# Altium schematic sheet Cyusb3314_Indicator.SchDoc
size 391 x 287 mm
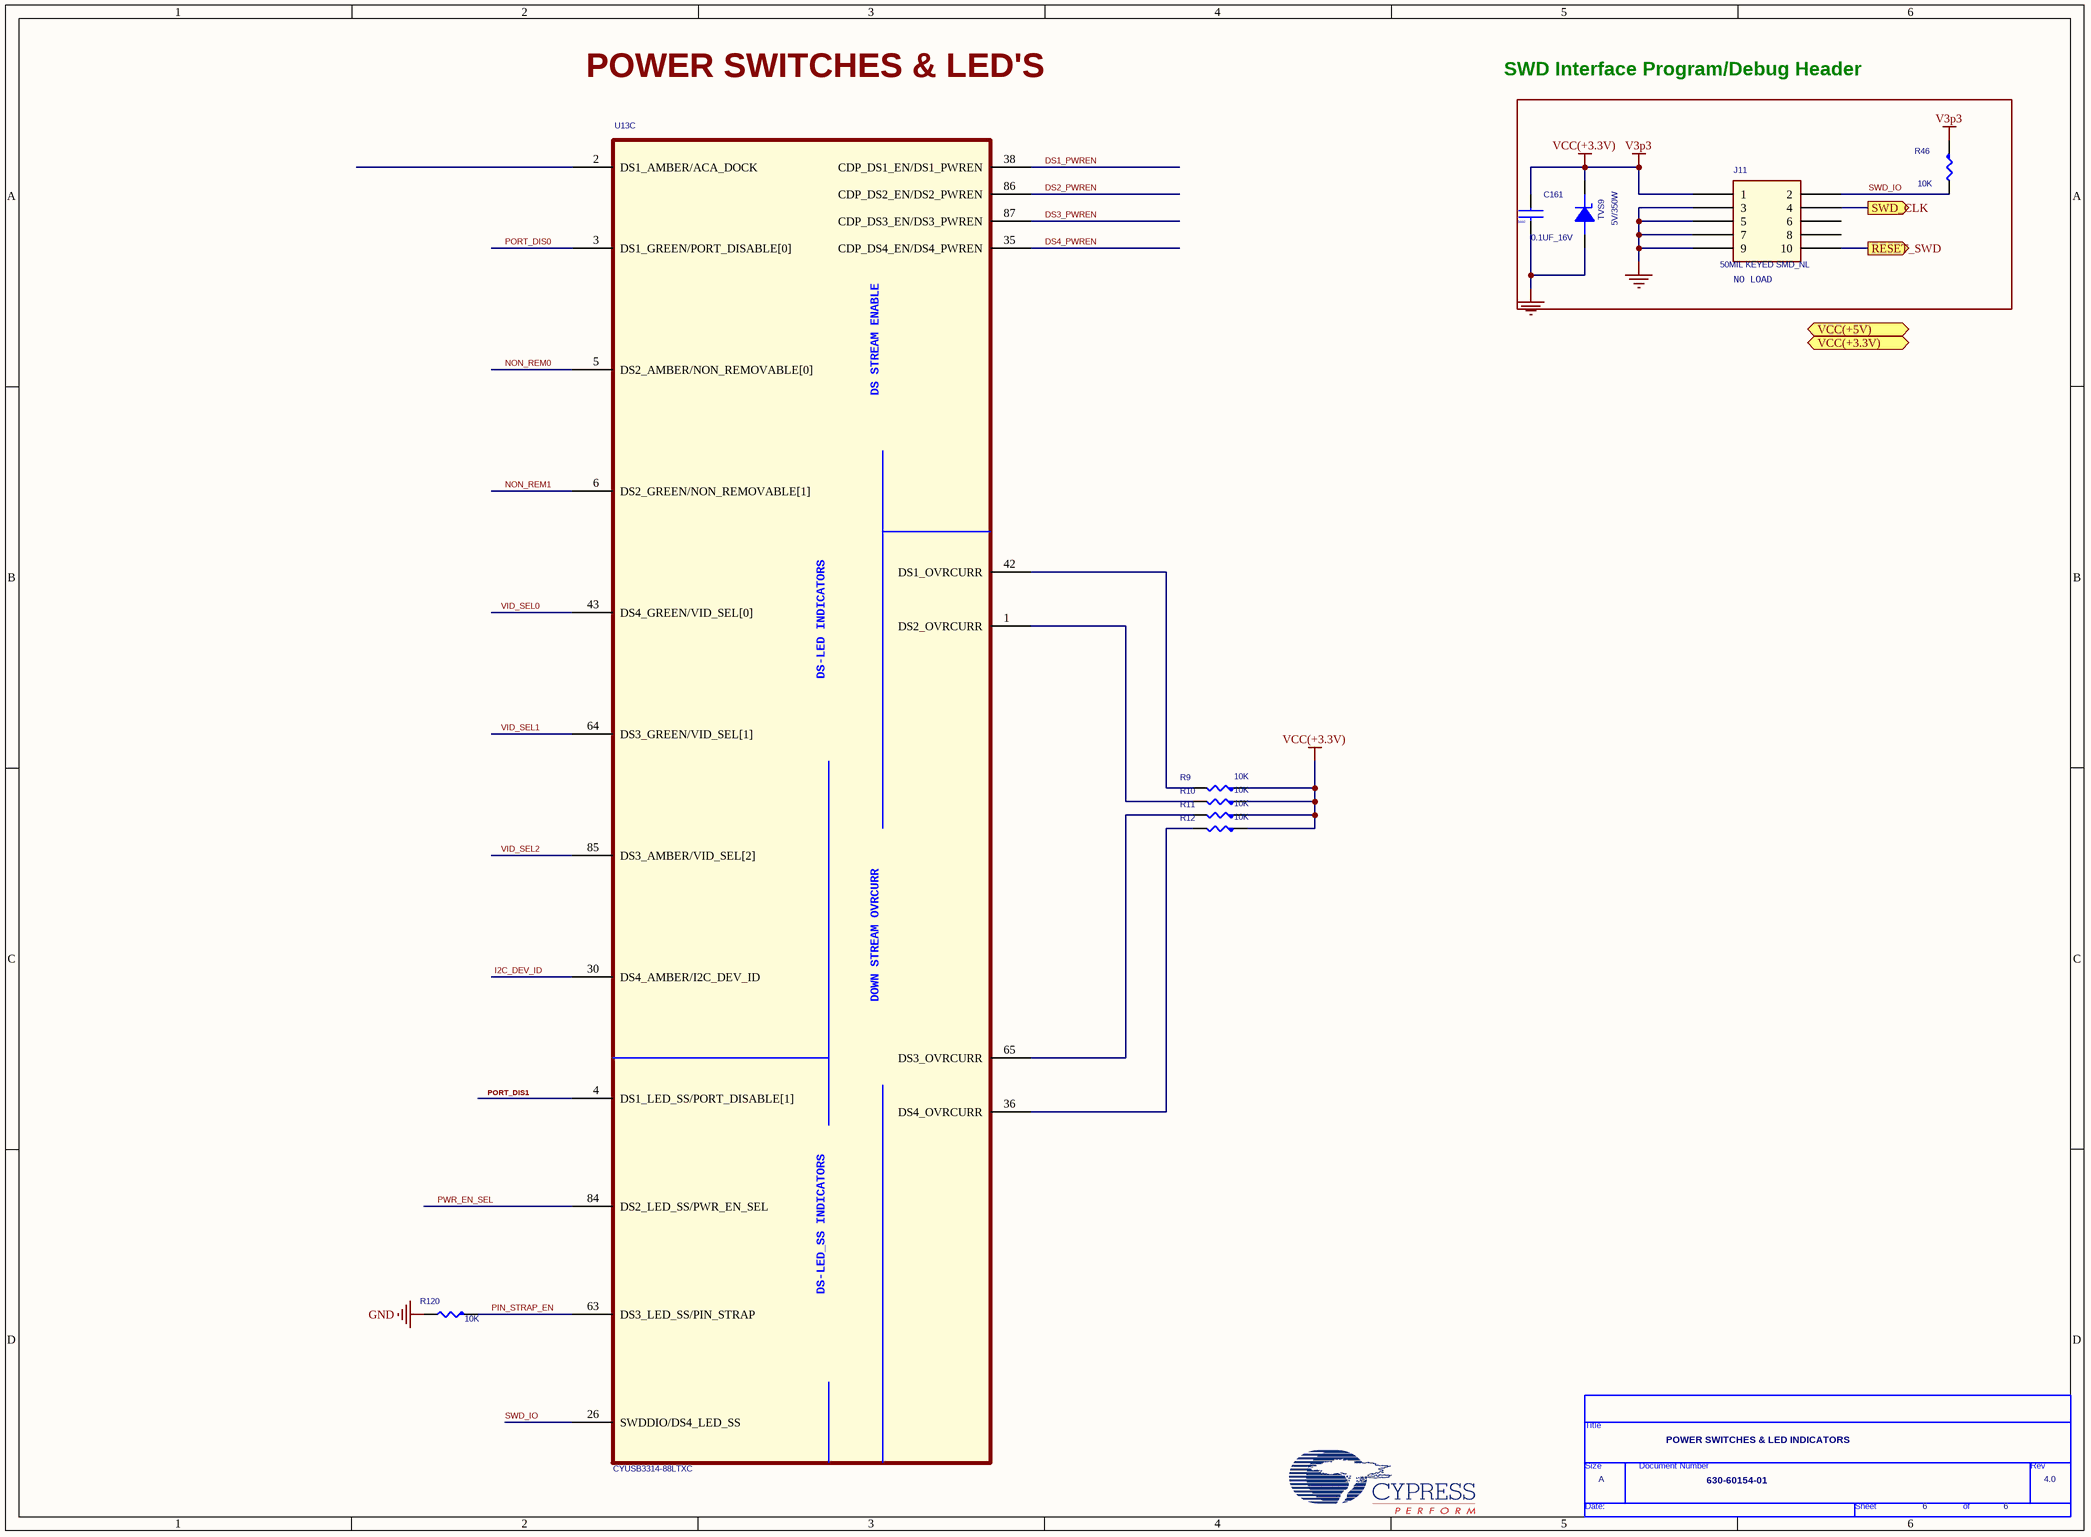
[diagram p0: Cyusb3314_Indicator.SchDoc]

## Parts
*  Page Count: 6  Page Size: A  Title: POWER SWITCHES & LED INDICATORS  RevCode: 4.0  Doc: 630-60154-01  (hidden comment: TitleBlock0)  (graphical)
C161  0.1UF_16V  [C0402]
J11  50MIL KEYED SMD_NL  [SAMTEC_FTSH-105-01-L-DV-K]
R9  10K  [0603S-RES]
R10  10K  [0603S-RES]
R11  10K  [0603S-RES]
R12  10K  [0603S-RES]
R46  10K  [0603S-RES]
R120  10K  [0603S-RES]
TVS9  5V/350W  [SOD2513X120M]
U13  CYUSB3314-88LTXC  [QFN40P1000X1000X100-89M]  (part C of 3)

## Blocks framed on the sheet
NO LOAD: C161 J11 R46 TVS9

## Ports
RESET_SWD (out), SWD_CLK (out), VCC(+3.3V) (in), VCC(+5V) (in)

## Nets
GND: C161.2 J11.3 J11.5 J11.7 J11.9 R120.2 TVS9.2(A)
V3p3: C161.1 J11.1 R9.1 R10.1 R11.1 R12.1 R46.1 TVS9.1(K)  [also labelled VCC(+3.3V)]
DS1_PWREN: U13.38(CDP_DS1_EN/DS1_PWREN)
DS2_PWREN: U13.86(CDP_DS2_EN/DS2_PWREN)
DS3_PWREN: U13.87(CDP_DS3_EN/DS3_PWREN)
DS4_PWREN: U13.35(CDP_DS4_EN/DS4_PWREN)
I2C_DEV_ID: U13.30(DS4_AMBER/I2C_DEV_ID)
NON_REM0: U13.5(DS2_AMBER/NON_REMOVABLE[0])
NON_REM1: U13.6(DS2_GREEN/NON_REMOVABLE[1])
PIN_STRAP_EN: R120.1 U13.63(DS3_LED_SS/PIN_STRAP)
PORT_DIS0: U13.3(DS1_GREEN/PORT_DISABLE[0])
PORT_DIS1: U13.4(DS1_LED_SS/PORT_DISABLE[1])
PWR_EN_SEL: U13.84(DS2_LED_SS/PWR_EN_SEL)
RESET_SWD: J11.10 ; port RESET_SWD
SWD_CLK: J11.4 ; port SWD_CLK
SWD_IO: J11.2 R46.2 U13.26(SWDDIO/DS4_LED_SS)
VID_SEL0: U13.43(DS4_GREEN/VID_SEL[0])
VID_SEL1: U13.64(DS3_GREEN/VID_SEL[1])
VID_SEL2: U13.85(DS3_AMBER/VID_SEL[2])
NetR9_2: R9.2 U13.42(DS1_OVRCURR)
NetR10_2: R10.2 U13.1(DS2_OVRCURR)
NetR11_2: R11.2 U13.65(DS3_OVRCURR)
NetR12_2: R12.2 U13.36(DS4_OVRCURR)

Not connected (* = marked no-connect by the designer): J11 6 8; U13 2(DS1_AMBER/ACA_DOCK)

## Notes on the sheet
- POWER SWITCHES & LED'S
- SWD Interface Program/Debug Header
- (in symbol 0.1 uFd 0402) 0402
- (in symbol CYUSB3314-88LTXC_2, part C) DS STREAM ENABLE; DS-LED INDICATORS; DOWN STREAM OVRCURR; DS-LED_SS INDICATORS
- (in symbol TitleBlock0) Title; Size; Document Number; Rev; Date:; Sheet; of

## Library data of the parts
C161 = 0.1 uFd 0402: CAP .1UF 16V CERAMIC Y5V 0402; Cy_part#: 730R-10010; Manufacturer: Panasonic - ECG; Part Number: ECJ-0EF1C104Z; DEVICE: 0p1uFd_0402; CLASS: DISCRETE; ALT_SYMBOLS: C-CC0402_A; VOLTAGE: 16V; Created by: SNF
J11 = 10 Pin Header 50mil Keyed SMD: CONN HEADER 10 PIN 50MIL KEYED SMD; Part Number: FTSH-105-01-L-DV-K; Manufacturer: Samtec; Cy_part#: 420R-14312; CLASS: IO; Last Edit By: SNF; DEVICE: HDR5x2x50KS
R9-R12 = R_Dup1: RES 200 OHM 1% 0603 SMD; Manufacturer: Stackpole; Part Number: RNCP0603FTD200R
R46 = R_Dup1: RES 10.0K OHM 1/10W 1% 0603 SMD; Manufacturer: Panasonic - ECG; Part Number: ERJ-3EKF1002V; Lead Free: YES
R120 = R_Dup1: Manufacturer: Panasonic; Part Number: ERJ-2RKF49.9X
TVS9 = TVS 5V SOD-323_0: TVS UNIDIR 350W 5V SOD-323; Part Number: SD05.TCT; Manufacturer: Dioded Inc.; CLASS: DISCRETE; DEVICE: SD05-7; LastEditBy: gir
U13 = CYUSB3314-88LTXC_2: Manufacturer: *; Part Number: CYUSB3314-88LTXC
* = TitleBlock0: Page Number: 6; Page Create Date: March  8, 1995